# EAGLE design msx_io_expander_slot (EAGLE 7.6.0)
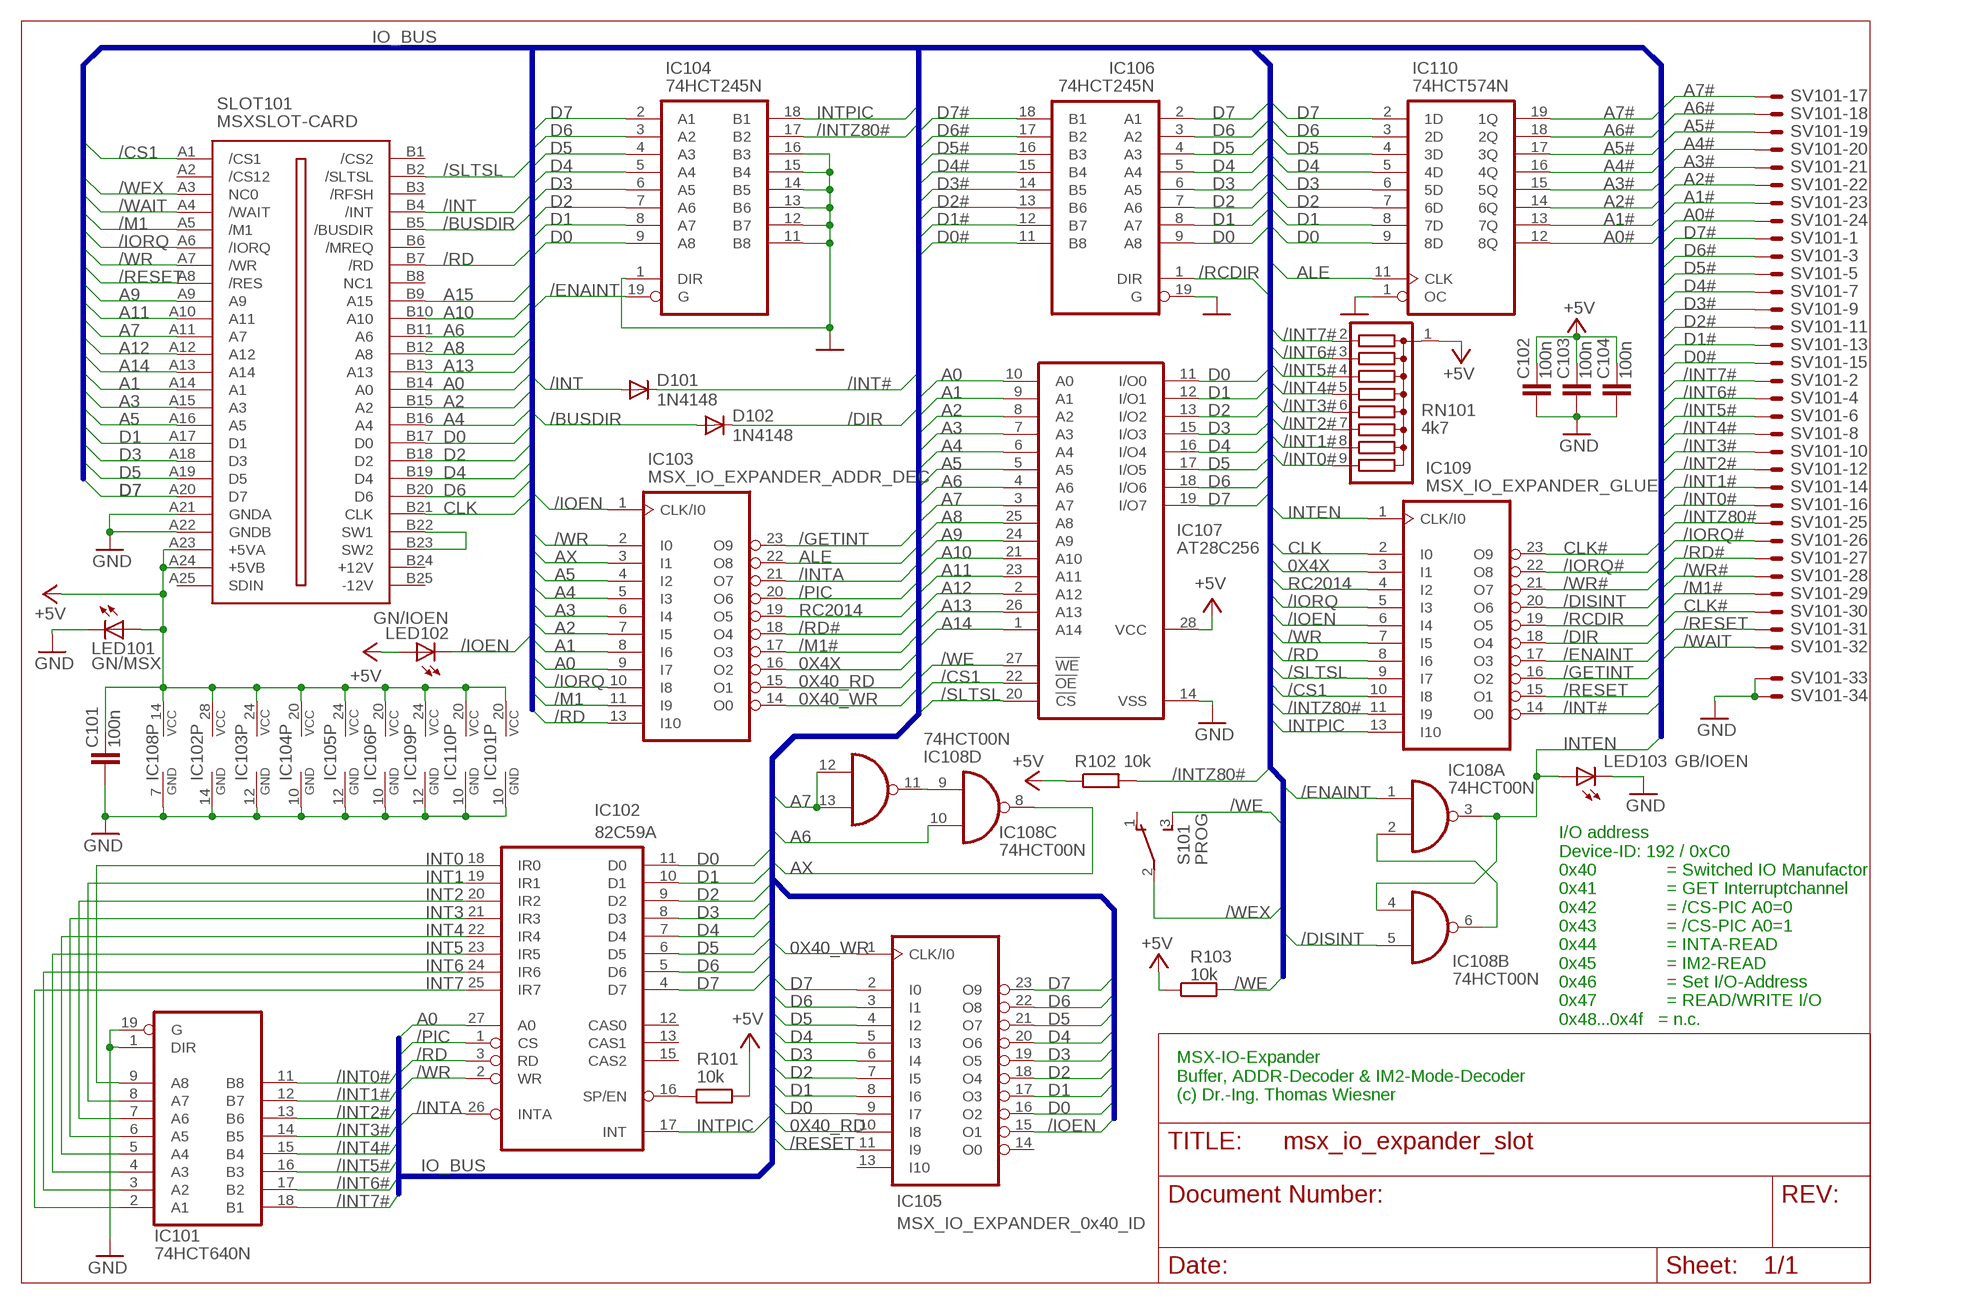
[diagram p0: schematic, sheet 1]

## Parts
C101  100n  C-EU025-025X050  [C025-025X050]
C102  100n  C-EU025-025X050  [C025-025X050]
C103  100n  C-EU025-025X050  [C025-025X050]
C104  100n  C-EU025-025X050  [C025-025X050]
D101  1N4148  1N4148DO35-10  [DO35-10]
D102  1N4148  1N4148DO35-10  [DO35-10]
IC101  74HCT640N  74HCT245N  [DIL20]
IC102  82C59A  8259A  [DIL28-6]
IC103  MSX_IO_EXPANDER_ADDR_DEC  22V10  [DIL24-3]
IC104  74HCT245N  [DIL20]
IC105  MSX_IO_EXPANDER_0x40_ID  22V10  [DIL24-3]
IC106  74HCT245N  [DIL20]
IC107  AT28C256  62256P  [DIL28-6]
IC108  74HCT00N  [DIL14]
IC109  MSX_IO_EXPANDER_GLUE  22V10  [DIL24-3]
IC110  74HCT574N  [DIL20]
LED101  GN/MSX  LED3MM  [LED3MM]
LED102  GN/IOEN  LED3MM  [LED3MM]
LED103  GB/IOEN  LED3MM  [LED3MM]
R101  10k  R-EU_0207/10  [0207/10]
R102  10k  R-EU_0207/10  [0207/10]
R103  10k  R-EU_0207/10  [0207/10]
RN101  4k7  G08R  [SIL9]
S101  PROG  TL36PO  [TL3XPO]
SLOT101  MSXSLOT-CARD  [MSXCARD]
SV101  ML343MLE  [3M_34L]

## Nets
0X4X: IC103.16(O2) IC109.3(I1)
0X40_RD: IC103.15(O1) IC105.10(I8)
0X40_WR: IC103.14(O0) IC105.1(CLK/I0)
+5V: C101.2 C102.2 C103.2 C104.2 IC101.20(VCC) IC102.28(VCC) IC103.24(VCC) IC104.20(VCC) IC105.24(VCC) IC106.20(VCC) IC107.28(VCC) IC108.14(P:VCC) IC109.24(VCC) IC110.20(VCC) LED101.A LED102.A R101.2 R102.1 R103.1 RN101.1 SLOT101.A23(+5VA) SLOT101.A24(+5VB)
/BUSDIR: D102.A SLOT101.B5(/BUSDIR)
/CS1: IC107.22(!OE) IC109.10(I8) SLOT101.A1(/CS1)
/DIR: D102.C IC109.18(O4)
/DISINT: IC108.5(B:I1) IC109.20(O6)
/ENAINT: IC104.19(G) IC108.1(A:I0) IC109.17(O3)
/GETINT: IC103.23(O9) IC109.16(O2)
/INT: D101.A SLOT101.B4(/INT)
/INT0#: IC101.11(B8) RN101.9 SV101.16
/INT1#: IC101.12(B7) RN101.8 SV101.14
/INT2#: IC101.13(B6) RN101.7 SV101.12
/INT3#: IC101.14(B5) RN101.6 SV101.10
/INT4#: IC101.15(B4) RN101.5 SV101.8
/INT5#: IC101.16(B3) RN101.4 SV101.6
/INT6#: IC101.17(B2) RN101.3 SV101.4
/INT7#: IC101.18(B1) RN101.2 SV101.2
/INT#: D101.C IC109.14(O0)
/INTA: IC102.26(INTA) IC103.21(O7)
/INTZ80#: IC104.17(B2) IC109.11(I9) R102.2 SV101.25
/IOEN: IC103.1(CLK/I0) IC105.15(O1) IC109.6(I4) LED102.K(C)
/IORQ: IC103.10(I8) IC109.5(I3) SLOT101.A6(/IORQ)
/IORQ#: IC109.22(O8) SV101.26
/M1: IC103.11(I9) SLOT101.A5(/M1)
/M1#: IC103.17(O3) SV101.29
/PIC: IC102.1(CS) IC103.20(O6)
/RCDIR: IC106.1(DIR) IC109.19(O5)
/RD: IC102.3(RD) IC103.13(I10) IC109.8(I6) SLOT101.B7(/RD)
/RD#: IC103.18(O4) SV101.27
/RESET: IC105.11(I9) IC109.15(O1) SLOT101.A8(/RES) SV101.31
/SLTSL: IC107.20(!CS) IC109.9(I7) SLOT101.B2(/SLTSL)
/WAIT: SLOT101.A4(/WAIT) SV101.32
/WE: IC107.27(!WE) R103.2 S101.3(S)
/WEX: S101.2(P) SLOT101.A3(NC0)
/WR: IC102.2(WR) IC103.2(I0) IC109.7(I5) SLOT101.A7(/WR)
/WR#: IC109.21(O7) SV101.28
A0: IC102.27(A0) IC103.9(I7) IC107.10(A0) SLOT101.B14(A0)
A0#: IC110.12(8Q) SV101.24
A1: IC103.8(I6) IC107.9(A1) SLOT101.A14(A1)
A1#: IC110.13(7Q) SV101.23
A2: IC103.7(I5) IC107.8(A2) SLOT101.B15(A2)
A2#: IC110.14(6Q) SV101.22
A3: IC103.6(I4) IC107.7(A3) SLOT101.A15(A3)
A3#: IC110.15(5Q) SV101.21
A4: IC103.5(I3) IC107.6(A4) SLOT101.B16(A4)
A4#: IC110.16(4Q) SV101.20
A5: IC103.4(I2) IC107.5(A5) SLOT101.A16(A5)
A5#: IC110.17(3Q) SV101.19
A6: IC107.4(A6) IC108.10(C:I1) SLOT101.B11(A6)
A6#: IC110.18(2Q) SV101.18
A7: IC107.3(A7) IC108.12(D:I0) IC108.13(D:I1) SLOT101.A11(A7)
A7#: IC110.19(1Q) SV101.17
A8: IC107.25(A8) SLOT101.B12(A8)
A9: IC107.24(A9) SLOT101.A9
A10: IC107.21(A10) SLOT101.B10(A10)
A11: IC107.23(A11) SLOT101.A10(A11)
A12: IC107.2(A12) SLOT101.A12
A13: IC107.26(A13) SLOT101.B13(A13)
A14: IC107.1(A14) SLOT101.A13(A14)
A15: SLOT101.B9(A15)
ALE: IC103.22(O8) IC110.11(CLK)
AX: IC103.3(I1) IC108.8(C:O)
CLK: IC109.2(I0) SLOT101.B21(CLK)
CLK#: IC109.23(O9) SV101.30
D0: IC102.11(D0) IC104.9(A8) IC105.9(I7) IC105.16(O2) IC106.9(A8) IC107.11(I/O0) IC110.9(8D) SLOT101.B17(D0)
D0#: IC106.11(B8) SV101.15
D1: IC102.10(D1) IC104.8(A7) IC105.8(I6) IC105.17(O3) IC106.8(A7) IC107.12(I/O1) IC110.8(7D) SLOT101.A17(D1)
D1#: IC106.12(B7) SV101.13
D2: IC102.9(D2) IC104.7(A6) IC105.7(I5) IC105.18(O4) IC106.7(A6) IC107.13(I/O2) IC110.7(6D) SLOT101.B18(D2)
D2#: IC106.13(B6) SV101.11
D3: IC102.8(D3) IC104.6(A5) IC105.6(I4) IC105.19(O5) IC106.6(A5) IC107.15(I/O3) IC110.6(5D) SLOT101.A18(D3)
D3#: IC106.14(B5) SV101.9
D4: IC102.7(D4) IC104.5(A4) IC105.5(I3) IC105.20(O6) IC106.5(A4) IC107.16(I/O4) IC110.5(4D) SLOT101.B19(D4)
D4#: IC106.15(B4) SV101.7
D5: IC102.6(D5) IC104.4(A3) IC105.4(I2) IC105.21(O7) IC106.4(A3) IC107.17(I/O5) IC110.4(3D) SLOT101.A19(D5)
D5#: IC106.16(B3) SV101.5
D6: IC102.5(D6) IC104.3(A2) IC105.3(I1) IC105.22(O8) IC106.3(A2) IC107.18(I/O6) IC110.3(2D) SLOT101.B20(D6)
D6#: IC106.17(B2) SV101.3
D7: IC102.4(D7) IC104.2(A1) IC105.2(I0) IC105.23(O9) IC106.2(A1) IC107.19(I/O7) IC110.2(1D) SLOT101.A20(D7)
D7#: IC106.18(B1) SV101.1
GND: C101.1 C102.1 C103.1 C104.1 IC101.1(DIR) IC101.10(GND) IC101.19(G) IC102.14(GND) IC103.12(GND) IC104.1(DIR) IC104.10(GND) IC104.11(B8) IC104.12(B7) IC104.13(B6) IC104.14(B5) IC104.15(B4) IC104.16(B3) IC105.12(GND) IC106.10(GND) IC106.19(G) IC107.14(VSS) IC108.7(P:GND) IC109.12(GND) IC110.1(OC) IC110.10(GND) LED101.K(C) LED103.K(C) SLOT101.A21(GNDA) SLOT101.A22(GNDB) SV101.33 SV101.34
INT0: IC101.9(A8) IC102.18(IR0)
INT1: IC101.8(A7) IC102.19(IR1)
INT2: IC101.7(A6) IC102.20(IR2)
INT3: IC101.6(A5) IC102.21(IR3)
INT4: IC101.5(A4) IC102.22(IR4)
INT5: IC101.4(A3) IC102.23(IR5)
INT6: IC101.3(A2) IC102.24(IR6)
INT7: IC101.2(A1) IC102.25(IR7)
INTEN: IC108.3(A:O) IC108.4(B:I0) IC109.1(CLK/I0) LED103.A
INTPIC: IC102.17(INT) IC104.18(B1) IC109.13(I10)
N$1: IC102.16(SP/EN) R101.1
N$2: IC108.2(A:I1) IC108.6(B:O)
N$3: SLOT101.B22(SW1) SLOT101.B23(SW2)
N$4: IC108.9(C:I0) IC108.11(D:O)
RC2014: IC103.19(O5) IC109.4(I2)
Unconnected: IC102.12(CAS0) IC102.13(CAS1) IC102.15(CAS2) IC105.13(I10) IC105.14(O0) S101.1(O) SLOT101.A2(/CS12) SLOT101.A25(SDIN) SLOT101.B1(/CS2) SLOT101.B3(/RFSH) SLOT101.B6(/MREQ) SLOT101.B8(NC1) SLOT101.B24(+12V) SLOT101.B25(-12V)

## Buses
IO_BUS

## Notes on the sheet
- I/O address
  Device-ID: 192 / 0xC0
  0x40              = Switched IO Manufactor
  0x41              = GET Interruptchannel
  0x42              = /CS-PIC A0=0
  0x43              = /CS-PIC A0=1
  0x44              = INTA-READ
  0x45              = IM2-READ
  0x46              = Set I/O-Address
  0x47              = READ/WRITE I/O
  0x48...0x4f   = n.c.
- MSX-IO-Expander
  Buffer, ADDR-Decoder & IM2-Mode-Decoder
  (c) Dr.-Ing. Thomas Wiesner

## Library data of the parts
C101-C104 = rcl:C-EU: CAPACITOR, European symbol
D101 D102 = diode:1N4148: DIODE high speed (Philips)
IC101 IC104 IC106 = 74xx-eu:74*245: Octal BUS TRANSCEIVER, 3-state
IC102 = micro-intel:8259A: MICROCOMPUTER/PERIPHERAL DEVICE; OC_FARNELL: unknown; OC_NEWARK: unknown
IC103 IC105 IC109 = pal:22V10: PAL; MPN: GAL22V10D-7LPN; OC_FARNELL: 1571925; OC_NEWARK: 97M0480
IC107 = memory-hitachi:62256P: MEMORY; OC_FARNELL: unknown; OC_NEWARK: unknown
IC108 = 74xx-eu:74*00: Quad 2-input NAND gate
IC110 = 74xx-eu:74*574: 8-bit D type FLIP FLOP bus driver
LED101-LED103 = led:LED: LED OSRAM: - CHIPLED LG R971, LG N971, LY N971, LG Q971, LY Q971, LO R971, LY R971 LH N974, LH R974 LS Q976, LO Q976, LY Q976 LO Q996 - Hyper CHIPLED LW Q18S LB Q993, LB Q99A, LB R99A - SideLED LS A670, LO A670, LY A670, LG A670, LP A670 LB A673, LV A673, LT A673, LW A673 LH A674 LY A675 LS A676, LA A676, LO A676, LY A676, LW A676 LS A679, LY A679, LG A679 - Hyper Micro SIDELED® LS Y876, LA Y876, LO Y876, LY Y876 LT Y87S - SmartLED LW L88C, LW L88S LB L89C, LB L89S, LG L890 LS L89K, LO L89K, LY L89K LS L896, LA L896, LO L896, LY L896 - TOPLED LS T670, LO T670, LY T670, LG T670, LP T670 LSG T670, LSP T670, LSY T670, LOP T670, LYG T670 LG T671, LOG T671, LSG T671 LB T673, LV T673, LT T673, LW T673 LH T674 LS T676, LA T676, LO T676, LY T676, LB T676, LH T676, LSB T676, LW T676 LB T67C, LV T67C, LT T67C, LS T67K, LO T67K, LY T67K, LW E67C LS E67B, LA E67B, LO E67B, LY E67B, LB E67C, LV E67C, LT E67C LW T67C LS T679, LY T679, LG T679 LS T770, LO T770, LY T770, LG T770, LP T770 LB T773, LV T773, LT T773, LW T773 LH T774 LS E675, LA E675, LY E675, LS T675 LS T776, LA T776, LO T776, LY T776, LB T776 LHGB T686 LT T68C, LB T68C - Hyper Mini TOPLED® LB M676 - Mini TOPLED Santana® LG M470 LS M47K, LO M47K, LY M47K Source: http://www.osram.convergy.de LUXEON: - LUMILED® LXK2-PW12-R00, LXK2-PW12-S00, LXK2-PW14-U00, LXK2-PW14-V00 LXK2-PM12-R00, LXK2-PM12-S00, LXK2-PM14-U00 LXK2-PE12-Q00, LXK2-PE12-R00, LXK2-PE12-S00, LXK2-PE14-T00, LXK2-PE14-U00 LXK2-PB12-K00, LXK2-PB12-L00, LXK2-PB12-M00, LXK2-PB14-N00, LXK2-PB14-P00, LXK2-PB14-Q00 LXK2-PR12-L00, LXK2-PR12-M00, LXK2-PR14-Q00, LXK2-PR14-R00 LXK2-PD12-Q00, LXK2-PD12-R00, LXK2-PD12-S00 LXK2-PH12-R00, LXK2-PH12-S00 LXK2-PL12-P00, LXK2-PL12-Q00, LXK2-PL12-R00 Source: www.luxeon.com KINGBRIGHT: KA-3528ASYC Source: www.kingbright.com
R101-R103 = resistor:R-EU_: RESISTOR, European symbol
RN101 = resistor-sil:G08R: SIL RESISTOR; OC_FARNELL: unknown; OC_NEWARK: unknown
S101 = switch:TL36PO: TINY SWITCH ON - ON Source: http://www2.produktinfo.conrad.com/datenblaetter/700000-724999/705152-da-01-de-Subminiaturschalter_TL_36YO.pdf
SLOT101 = mbc:MSXSLOT: MSX-Slot-Verbinder
SV101 = con-harting-ml:ML34?E: HARTING; OC_FARNELL: unknown; OC_NEWARK: unknown

## Board
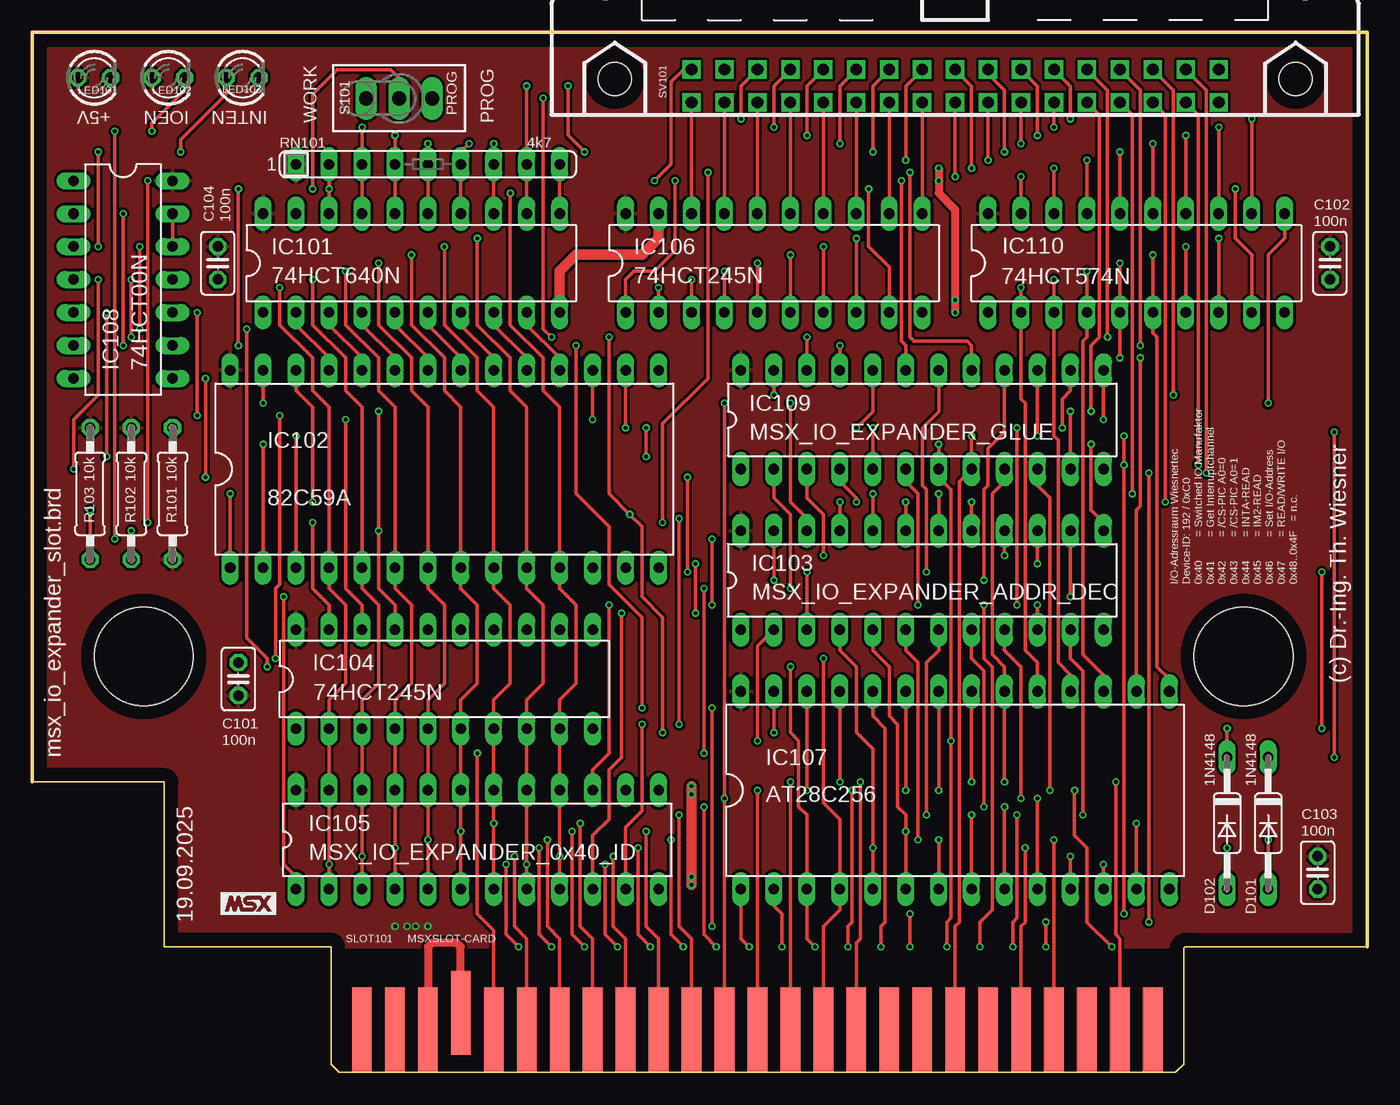
[diagram p1: board, top side]
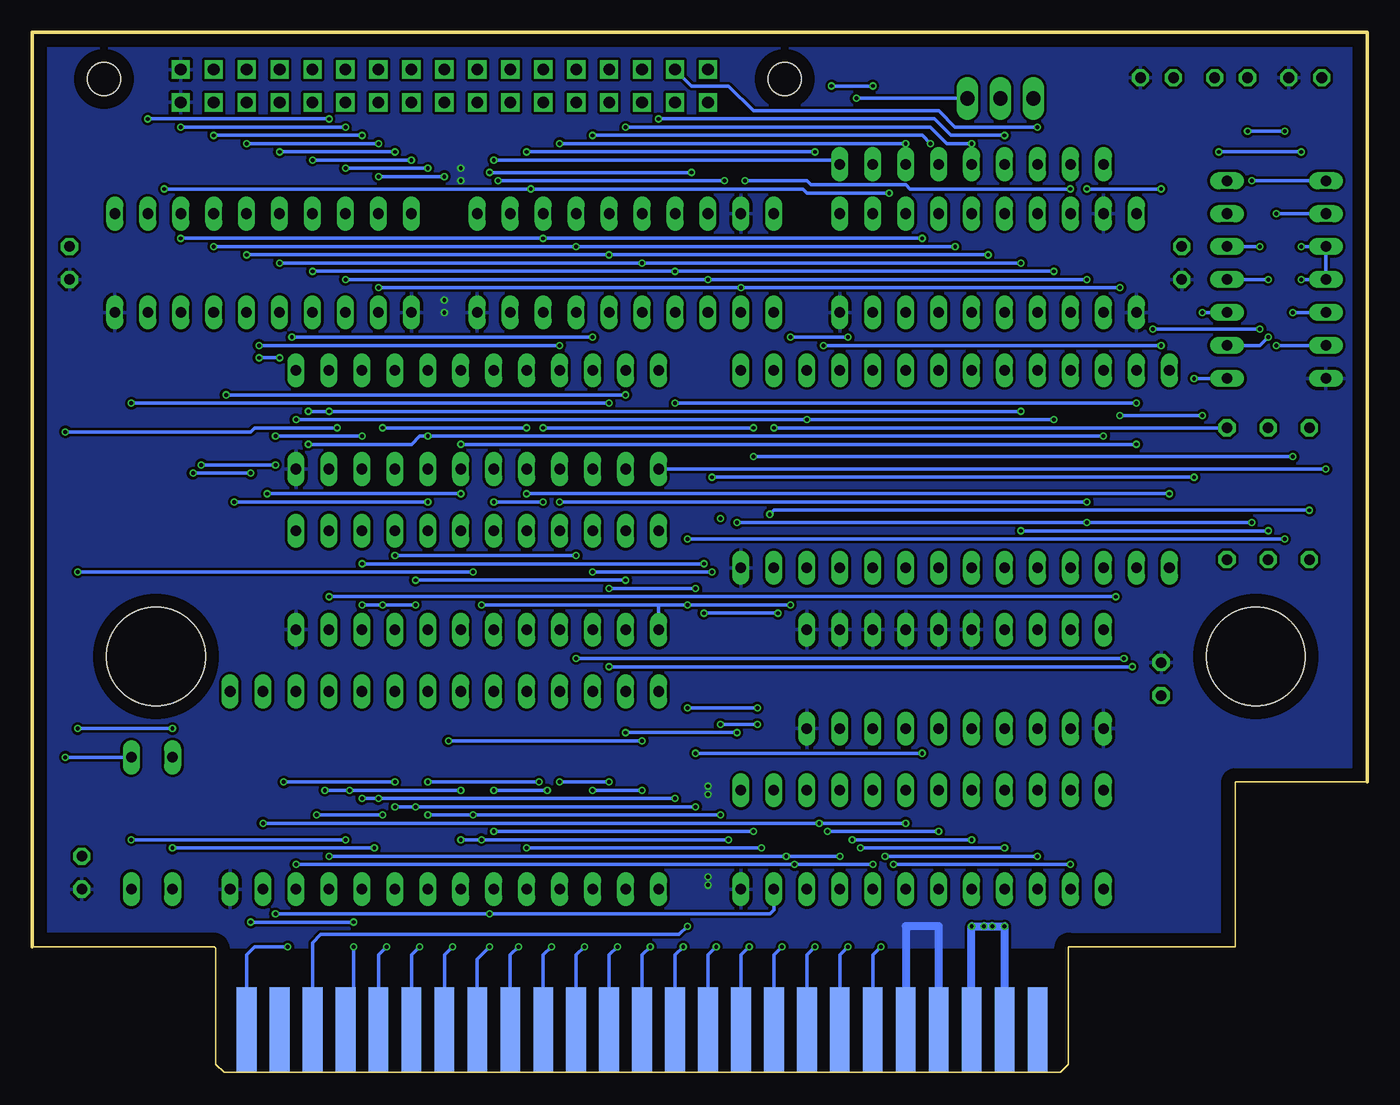
[diagram p2: board, bottom side, seen from below]

Size 102.87 x 80.17 mm. Coordinates in mm from the lower left corner, seen from the top.
Outline: 0,22.38 0,80.17 102.87,80.17 102.87,9.68
Copper layers (1*16): Top 0.035mm / dielectric 1.5mm / Bottom 0.035mm
Design rules "default *": minimum track width 10mil, minimum drill 0.3mm, track to track 8mil, track to pad 4mil, pad to pad 8mil, via to via 8mil, smd to smd 8mil, copper to edge 40mil, drill to drill 8mil, minimum pad ring 10mil, minimum via ring 0.125mm, stop-mask expansion 4mil, vias tented up to drill 0mil, thermal gap 10mil

### Footprints (pad centres in the part's own frame; a part is rotated, then mirrored left to right if it is on the bottom)
C025-025X050 = drill 0.813 octagon: 1 -1.27,0; 2 1.27,0
DO35-10 = drill 0.813 long: A 5.08,0; C -5.08,0
DIL20 = drill 0.813 long: 1 -11.43,-3.81; 2 -8.89,-3.81; 3 -6.35,-3.81; 4 -3.81,-3.81; 5 -1.27,-3.81; 6 1.27,-3.81; 7 3.81,-3.81; 8 6.35,-3.81; 9 8.89,-3.81; 10 11.43,-3.81; 11 11.43,3.81; 12 8.89,3.81; 13 6.35,3.81; 14 3.81,3.81; 15 1.27,3.81; 16 -1.27,3.81; 17 -3.81,3.81; 18 -6.35,3.81; 19 -8.89,3.81; 20 -11.43,3.81
DIL28-6 = drill 0.813 long: 1 -16.51,-7.62; 2 -13.97,-7.62; 3 -11.43,-7.62; 4 -8.89,-7.62; 5 -6.35,-7.62; 6 -3.81,-7.62; 7 -1.27,-7.62; 8 1.27,-7.62; 9 3.81,-7.62; 10 6.35,-7.62; 11 8.89,-7.62; 12 11.43,-7.62; 13 13.97,-7.62; 14 16.51,-7.62; 15 16.51,7.62; 16 13.97,7.62; 17 11.43,7.62; 18 8.89,7.62; 19 6.35,7.62; 20 3.81,7.62; 21 1.27,7.62; 22 -1.27,7.62; 23 -3.81,7.62; 24 -6.35,7.62; 25 -8.89,7.62; 26 -11.43,7.62; 27 -13.97,7.62; 28 -16.51,7.62
DIL24-3 = drill 0.813 long: 1 -13.97,-3.81; 2 -11.43,-3.81; 3 -8.89,-3.81; 4 -6.35,-3.81; 5 -3.81,-3.81; 6 -1.27,-3.81; 7 1.27,-3.81; 8 3.81,-3.81; 9 6.35,-3.81; 10 8.89,-3.81; 11 11.43,-3.81; 12 13.97,-3.81; 13 13.97,3.81; 14 11.43,3.81; 15 8.89,3.81; 16 6.35,3.81; 17 3.81,3.81; 18 1.27,3.81; 19 -1.27,3.81; 20 -3.81,3.81; 21 -6.35,3.81; 22 -8.89,3.81; 23 -11.43,3.81; 24 -13.97,3.81
DIL14 = drill 0.813 long: 1 -7.62,-3.81; 2 -5.08,-3.81; 3 -2.54,-3.81; 4 0,-3.81; 5 2.54,-3.81; 6 5.08,-3.81; 7 7.62,-3.81; 8 7.62,3.81; 9 5.08,3.81; 10 2.54,3.81; 11 0,3.81; 12 -2.54,3.81; 13 -5.08,3.81; 14 -7.62,3.81
LED3MM = drill 0.813 octagon: A -1.27,0; K 1.27,0
0207/10 = drill 0.813 octagon: 1 -5.08,0; 2 5.08,0
SIL9 = drill 0.813 long: 1 -10.16,0; 2 -7.62,0; 3 -5.08,0; 4 -2.54,0; 5 0,0; 6 2.54,0; 7 5.08,0; 8 7.62,0; 9 10.16,0
TL3XPO = drill 1.1 pad 1.422 long: 1 -2.54,0; 2 0,0; 3 2.54,0
MSXCARD = smd 1.524 x 6.477 bottom: A1 -25.4,2.54; A2 -27.94,2.54; A3 -30.48,2.54; A4 -33.02,2.54; A5 -35.56,2.54; A6 -38.1,2.54; A7 -40.64,2.54; A8 -43.18,2.54; A9 -45.72,2.54; A10 -48.26,2.54; A11 -50.8,2.54; A12 -53.34,2.54; A13 -55.88,2.54; A14 -58.42,2.54; A15 -60.96,2.54; A16 -63.5,2.54; A17 -66.04,2.54; A18 -68.58,2.54; A19 -71.12,2.54; A20 -73.66,2.54; A21 -76.2,2.54; A22 -78.74,2.54; A23 -81.28,2.54; A24 -83.82,2.54; A25 -86.36,2.54 | smd 1.524 x 6.477: B1 -25.4,2.54; B2 -27.94,2.54; B3 -30.48,2.54; B4 -33.02,2.54; B5 -35.56,2.54; B6 -38.1,2.54; B7 -40.64,2.54; B8 -43.18,2.54; B9 -45.72,2.54; B10 -48.26,2.54; B11 -50.8,2.54; B12 -53.34,2.54; B13 -55.88,2.54; B14 -58.42,2.54; B15 -60.96,2.54; B16 -63.5,2.54; B17 -66.04,2.54; B18 -68.58,2.54; B19 -71.12,2.54; B20 -73.66,2.54; B21 -76.2,2.54; B22 -78.74,3.81; B23 -81.28,2.54; B24 -83.82,2.54; B25 -86.36,2.54 | hole 7.62: -103.188,31.274; -18.415,31.274
3M_34L = drill 0.9 square: 1 -20.32,-5.08; 2 -20.32,-2.54; 3 -17.78,-5.08; 4 -17.78,-2.54; 5 -15.24,-5.08; 6 -15.24,-2.54; 7 -12.7,-5.08; 8 -12.7,-2.54; 9 -10.16,-5.08; 10 -10.16,-2.54; 11 -7.62,-5.08; 12 -7.62,-2.54; 13 -5.08,-5.08; 14 -5.08,-2.54; 15 -2.54,-5.08; 16 -2.54,-2.54; 17 0,-5.08; 18 0,-2.54; 19 2.54,-5.08; 20 2.54,-2.54; 21 5.08,-5.08; 22 5.08,-2.54; 23 7.62,-5.08; 24 7.62,-2.54; 25 10.16,-5.08; 26 10.16,-2.54; 27 12.7,-5.08; 28 12.7,-2.54; 29 15.24,-5.08; 30 15.24,-2.54; 31 17.78,-5.08; 32 17.78,-2.54; 33 20.32,-5.08; 34 20.32,-2.54 | hole 2.54: -26.238,-3.277; 26.238,-3.277

### Placement (x,y rotation side)
C101  15.88,30.32 270 top
C102  100.01,62.39 90 top
C103  99.06,15.4 90 top
C104  14.29,62.39 90 top
D101  95.25,19.21 270 top
D102  92.08,19.21 270 top
IC101  29.21,62.39 0 top
IC102  31.75,46.51 0 top
IC103  68.58,37.94 0 top
IC104  31.75,30.32 0 top
IC105  34.29,17.94 0 top
IC106  57.15,62.39 0 top
IC107  71.12,21.75 0 top
IC108  6.99,61.12 270 top
IC109  68.58,50.32 0 top
IC110  85.09,62.39 0 top
LED101  4.76,76.68 0 top
LED102  10.48,76.68 0 top
LED103  16.19,76.68 0 top
R101  10.79,44.61 270 top
R102  7.62,44.61 270 top
R103  4.45,44.61 270 top
RN101  30.48,70.01 0 top
S101  28.26,75.09 0 top
SLOT101  111.76,0.79 0 top
SV101  71.12,79.85 0 top

### Tracks (layer width: path | path; a pad name or v marks a point on that pad's centre or on a via)
0X4X  (via drill 0.3)
  Top 0.254: IC109.3 59.69,44.29 60.96,43.02 v60.96,39.85 | v74.93,39.85 IC103.16
  Bottom 0.254: v60.96,39.85 v74.93,39.85
0X40_RD  (via drill 0.3)
  Top 0.254: IC105.10 43.18,18.26 44.45,19.53 44.45,23.34 45.4,24.29 v45.4,35.4 | v51.12,35.4 v51.12,39.21 | v77.47,39.21 IC103.15
  Bottom 0.254: v45.4,35.4 v51.12,35.4 | v51.12,39.21 v77.47,39.21
0X40_WR  (via drill 0.3)
  Top 0.254: IC105.1 20.32,15.08 19.37,16.03 v19.37,36.67 | v80.01,36.67 IC103.14
  Bottom 0.254: v19.37,36.67 v80.01,36.67
+5V  (via drill 0.3)
  Bottom 0.61: SLOT101.A23 v30.48,11.27 v29.53,11.27 v28.89,11.27 v27.94,11.27 SLOT101.A24
  pour Top: 0,80.17 102.87,80.17 102.87,9.68 10.16,9.68 10.16,22.38 0,22.38
/BUSDIR  (via drill 0.3)
  Top 0.254: SLOT101.B5 76.2,11.27 76.52,11.59 v76.52,17.3 | v92.08,17.3 D102.A
  Bottom 0.254: v76.52,17.3 v92.08,17.3
/CS1  (via drill 0.3)
  Top 0.254: v83.19,9.68 81.28,11.59 81.28,17.3 80.33,18.26 v80.33,21.75 | v69.85,21.75 IC107.22 | IC109.10 77.47,45.24 78.42,44.29 v78.42,21.75
  Bottom 0.254: v83.19,9.68 85.72,9.68 86.36,9.05 SLOT101.A1 | v80.33,21.75 v78.42,21.75 v69.85,21.75
/DIR  (via drill 0.3)
  Top 0.254: IC109.18 69.85,50.96 68.58,49.69 68.58,45.24 68.9,44.93 v68.9,38.58 | v99.38,38.58 v99.38,26.51 | v92.08,26.51 D102.C
  Bottom 0.254: v68.9,38.58 v99.38,38.58 | v99.38,26.51 v92.08,26.51
/DISINT  (via drill 0.3)
  Top 0.254: v5.71,58.58 v5.71,47.47 | IC109.20 64.77,50.96 v63.5,49.69 | v47.31,49.69 v47.31,47.47
  Bottom 0.254: IC108.5 v5.71,58.58 | v5.71,47.47 v47.31,47.47 | v63.5,49.69 v47.31,49.69
/ENAINT  (via drill 0.3)
  Top 0.254: IC104.19 22.86,36.04 21.59,37.31 v21.59,42.39 | v8.89,42.39 v8.89,68.74 | IC109.17 72.39,56.04 72.07,56.36 67.94,56.36 67.63,56.67 v67.63,69.37 | v48.58,42.39 48.58,50.01 52.07,53.5 v52.07,69.37
  Bottom 0.254: v8.89,42.39 v21.59,42.39 v48.58,42.39 | v8.89,68.74 IC108.1 | v67.63,69.37 v52.07,69.37
/GETINT  (via drill 0.3)
  Top 0.254: IC109.16 74.93,49.37 73.66,48.1 73.66,45.24 73.34,44.93 v73.34,37.94 | v57.15,37.94 IC103.23
  Bottom 0.254: v73.34,37.94 v57.15,37.94
/INT  (via drill 0.3)
  Top 0.254: SLOT101.B4 v78.74,17.94 | v95.25,17.94 D101.A
  Bottom 0.254: v78.74,17.94 v95.25,17.94
/INT0#  (via drill 0.3)
  Top 0.254: SV101.16 67.31,76.04 v67.31,70.33 | IC101.11 RN101.9
  Bottom 0.254: v67.31,70.33 40.96,70.33 RN101.9
/INT1#  (via drill 0.3)
  Top 0.254: SV101.14 64.77,76.04 v64.77,70.96 | v42.55,70.96 41.27,72.23 v41.27,76.04 | v38.1,76.04 RN101.8 IC101.12
  Bottom 0.254: v64.77,70.96 v42.55,70.96 | v41.27,76.04 v38.1,76.04
/INT2#  (via drill 0.3)
  Top 0.254: SV101.12 62.23,76.04 v62.23,71.6 | IC101.13 RN101.7 v35.56,71.6
  Bottom 0.254: v62.23,71.6 v35.56,71.6
/INT3#  (via drill 0.3)
  Top 0.254: SV101.10 59.69,76.04 v59.69,72.23 | IC101.14 RN101.6 33.02,70.64 33.02,70.96 v33.66,71.6
  Bottom 0.254: v59.69,72.23 34.29,72.23 v33.66,71.6
/INT4#  (via drill 0.3)
  Top 0.254: SV101.8 57.15,76.04 v57.15,72.87 | IC101.15 RN101.5 v30.48,71.6
  Bottom 0.254: v57.15,72.87 33.66,72.87 32.38,71.6 v30.48,71.6
/INT5#  (via drill 0.3)
  Top 0.254: SV101.6 54.61,76.04 v54.61,73.5 | IC101.16 RN101.4 v27.94,72.23
  Bottom 0.254: v54.61,73.5 33.34,73.5 32.07,72.23 v27.94,72.23
/INT6#  (via drill 0.3)
  Top 0.254: IC101.17 RN101.3 v25.4,72.87
  Bottom 0.254: SV101.4 52.07,76.04 49.21,76.04 47.31,74.14 33.02,74.14 31.75,72.87 v25.4,72.87
/INT7#  (via drill 0.3)
  Top 0.254: IC101.18 v22.86,68.1 RN101.2 | SV101.2 50.16,77.31 49.21,76.36 49.21,70.01 v47.94,68.74
  Bottom 0.254: v47.94,68.74 43.18,68.74 42.86,68.42 35.56,68.42 35.24,68.1 v22.86,68.1
/INT#  (via drill 0.3)
  Top 0.254: IC109.14 80.01,52.55 79.38,51.91 v79.38,49.69 | v100.33,49.37 v100.33,24.29
  Bottom 0.254: v79.38,49.69 85.72,49.69 86.04,49.37 v100.33,49.37 | v100.33,24.29 D101.C
/INTA  (via drill 0.3)
  Top 0.254: IC102.26 20.32,52.55 21.59,51.28 v21.59,43.97 | v62.23,43.97 IC103.21
  Bottom 0.254: v21.59,43.97 v62.23,43.97
/INTZ80#  (via drill 0.3)
  Top 0.254: SV101.25 82.23,73.82 82.23,56.67 81.6,56.04 v81.6,50.96 | v26.67,50.96 v26.67,41.75 26.67,37.31 27.94,36.04 IC104.17 | R102.2 v7.62,41.75 | IC109.11 v80.01,50.96
  Bottom 0.254: v81.6,50.96 v80.01,50.96 v26.67,50.96 | v7.62,41.75 v26.67,41.75
/IOEN  (via drill 0.3)
  Top 0.254: LED102.K 11.75,75.72 9.21,73.18 v9.21,72.55 | v6.35,72.55 v6.35,41.12 | v52.39,41.12 v52.39,36.04 | IC109.6 67.31,45.56 68.26,44.61 v68.26,36.04 | IC105.15 43.18,23.34 44.45,24.61 v44.45,36.04
  Bottom 0.254: v9.21,72.55 v6.35,72.55 | v6.35,41.12 v52.39,41.12 | 54.61,36.04 v52.39,36.04 v44.45,36.04 | 54.61,36.04 IC103.1 | v68.26,36.04 54.61,36.04
/IORQ  (via drill 0.3)
  Top 0.254: v73.03,9.68 73.03,11.59 73.98,12.54 73.98,31.27 73.34,31.91 v73.34,36.04 | v77.47,36.04 IC103.10 | IC109.5 v64.77,49.69 | v75.88,49.69 v75.88,36.04
  Bottom 0.254: SLOT101.A6 73.66,9.05 v73.03,9.68 | v73.34,36.04 v75.88,36.04 v77.47,36.04 | v64.77,49.69 v75.88,49.69
/IORQ#  (via drill 0.3)
  Top 0.254: SV101.26 82.87,75.72 v82.87,56.67 | v59.69,56.67 IC109.22
  Bottom 0.254: v82.87,56.67 v59.69,56.67
/M1  (via drill 0.3)
  Top 0.254: v75.56,9.68 75.56,11.59 75.88,11.91 v75.88,19.84 | v80.96,19.84 80.96,30.96 80.01,31.91 IC103.11
  Bottom 0.254: SLOT101.A5 76.2,9.05 v75.56,9.68 | v75.88,19.84 v80.96,19.84
/M1#  (via drill 0.3)
  Top 0.254: SV101.29 87.31,73.82 v87.31,43.97 | v72.39,43.97 IC103.17
  Bottom 0.254: v87.31,43.97 v72.39,43.97
/PIC  (via drill 0.3)
  Top 0.254: IC102.1 v15.24,44.61 | v64.77,44.61 IC103.20
  Bottom 0.254: v15.24,44.61 v64.77,44.61
/RCDIR  (via drill 0.3)
  Top 0.254: IC109.19 67.31,56.04 66.99,56.36 v66.99,68.74 | v49.53,68.74 49.53,63.34 47.94,61.75 46.35,61.75 45.72,61.12 IC106.1 45.72,57.63
  Bottom 0.254: v66.99,68.74 v49.53,68.74
/RD  (via drill 0.3)
  Top 0.254: v72.39,49.05 IC109.8 71.44,45.56 71.44,11.59 71.12,11.27 SLOT101.B7 | v20.32,49.05 IC102.3 | IC103.13 82.55,42.39 81.6,43.34 v81.6,48.42
  Bottom 0.254: v20.32,49.05 v72.39,49.05 73.03,49.05 73.66,48.42 v81.6,48.42
/RD#  (via drill 0.3)
  Top 0.254: SV101.27 84.77,73.82 v84.77,44.61 | v69.85,44.61 IC103.18
  Bottom 0.254: v84.77,44.61 v69.85,44.61
/RESET  (via drill 0.3)
  Top 0.254: SV101.31 89.85,73.82 v89.85,46.83 | v84.14,12.22 v84.14,46.83 v84.14,49.05 | v67.63,9.68 v67.63,12.22 | v49.85,42.7 v49.85,26.83 | v46.99,26.83 46.99,20.16 45.72,18.89 IC105.11 | v77.47,49.05 IC109.15
  Bottom 0.254: v89.85,46.83 v84.14,46.83 | v84.14,12.22 v67.63,12.22 46.04,12.22 45.72,12.54 IC105.11 | SLOT101.A8 68.58,8.73 v67.63,9.68 | v49.85,26.83 v46.99,26.83 | v84.14,49.05 v77.47,49.05
/SLTSL  (via drill 0.3)
  Top 0.254: SLOT101.B2 83.82,10.32 83.5,10.64 v83.5,22.38 | v74.93,22.38 IC107.20 74.93,31.27 73.98,32.23 73.98,44.61 74.93,45.56 IC109.9
  Bottom 0.254: v83.5,22.38 v74.93,22.38
/WAIT  (via drill 0.3)
  Top 0.254: SV101.32 90.49,75.72 v90.49,46.2 | v86.04,46.2 v86.04,11.59 | v78.11,11.59 v78.11,9.68
  Bottom 0.254: v90.49,46.2 v86.04,46.2 | v86.04,11.59 v78.11,11.59 | v78.11,9.68 78.11,6.51 SLOT101.A4
/WE  (via drill 0.3)
  Top 0.254: v39.37,75.09 39.37,57.31 v40.01,56.67 | v44.45,56.67 44.45,44.61 v46.04,43.02 46.99,42.07 46.99,36.67 48.58,35.08 v48.58,26.19 | v57.15,26.19 IC107.27 | R103.2 v4.45,43.34
  Bottom 0.254: S101.3 v39.37,75.09 | v40.01,56.67 v44.45,56.67 | v48.58,26.19 v57.15,26.19 | v4.45,43.34 45.72,43.34 v46.04,43.02
/WEX  (via drill 0.3)
  Top 0.254: v52.39,11.27 v52.39,28.1 | v46.99,28.1 46.99,35.08 44.45,37.62 44.45,42.07 41.91,44.61 v41.91,56.04 | v15.88,56.04 v15.88,68.1 | v21.59,68.1 21.59,75.41 23.5,77.31 27.62,77.31 28.26,76.68 S101.2
  Bottom 0.254: SLOT101.A3 81.28,10 80.64,10.64 53.02,10.64 v52.39,11.27 | v52.39,28.1 v46.99,28.1 | v41.91,56.04 v15.88,56.04 | v15.88,68.1 v21.59,68.1
/WR  (via drill 0.3)
  Top 0.254: v69.85,48.42 IC109.7 69.85,45.88 70.8,44.93 v70.8,25.56 70.8,11.91 70.48,11.59 v70.48,9.68 | v17.78,48.42 IC102.2 | IC103.2 55.88,32.86 v55.88,25.56
  Bottom 0.254: v69.85,48.42 v17.78,48.42 | SLOT101.A7 71.12,9.05 v70.48,9.68 | v55.88,25.56 v70.8,25.56
/WR#  (via drill 0.3)
  Top 0.254: SV101.28 85.41,75.72 v85.41,56.04 | v62.23,56.04 IC109.21
  Bottom 0.254: v85.41,56.04 v62.23,56.04
A0  (via drill 0.3)
  Top 0.254: v53.34,51.59 v53.34,21.11 SLOT101.B14 | v17.78,51.59 IC102.27 | v77.47,21.11 IC107.10 | IC103.9 74.93,32.54 76.2,31.27 v76.2,21.11
  Bottom 0.254: v53.34,51.59 v17.78,51.59 | v53.34,21.11 v76.2,21.11 v77.47,21.11
A0#  (via drill 0.3)
  Top 0.254: SV101.24 80.01,76.04 v80.01,73.5 | v93.98,73.5 IC110.12
  Bottom 0.254: v80.01,73.5 v93.98,73.5
A1  (via drill 0.3)
  Top 0.254: v52.7,9.68 51.75,10.64 v51.75,20.48 | v74.93,20.48 IC107.9 | IC103.8 72.39,31.91 73.34,30.96 v73.34,20.48
  Bottom 0.254: SLOT101.A14 53.34,9.05 v52.7,9.68 | v51.75,20.48 v73.34,20.48 v74.93,20.48
A1#  (via drill 0.3)
  Top 0.254: SV101.23 v78.74,72.87 | v91.44,72.87 IC110.13
  Bottom 0.254: v78.74,72.87 v91.44,72.87
A2  (via drill 0.3)
  Top 0.254: SLOT101.B15 50.8,10.32 49.85,11.27 v49.85,19.84 | v72.39,19.84 IC107.8 | IC103.7 69.85,32.54 68.9,31.59 v68.9,19.84
  Bottom 0.254: v49.85,19.84 v68.9,19.84 v72.39,19.84
A2#  (via drill 0.3)
  Top 0.254: SV101.22 77.47,76.04 v77.47,72.23 | v88.9,72.23 IC110.14
  Bottom 0.254: v77.47,72.23 v88.9,72.23
A3  (via drill 0.3)
  Top 0.254: v50.16,9.68 49.21,10.64 v49.21,17.94 | v69.85,17.94 IC107.7 | IC103.6 67.31,32.54 68.26,31.59 v68.26,17.94
  Bottom 0.254: SLOT101.A15 50.8,9.05 v50.16,9.68 | v49.21,17.94 v68.26,17.94 v69.85,17.94
A3#  (via drill 0.3)
  Top 0.254: SV101.21 v76.2,71.6 | v86.36,71.6 IC110.15
  Bottom 0.254: v76.2,71.6 v86.36,71.6
A4  (via drill 0.3)
  Top 0.254: SLOT101.B16 48.26,10.32 47.31,11.27 v47.31,18.57 | IC107.6 v67.31,18.57 67.31,19.84 66.67,20.48 66.67,26.83 66.04,27.46 66.04,31.27 64.77,32.54 IC103.5
  Bottom 0.254: v47.31,18.57 v67.31,18.57
A4#  (via drill 0.3)
  Top 0.254: SV101.20 73.66,76.99 74.93,75.72 v74.93,70.96 | v83.82,70.96 IC110.16
  Bottom 0.254: v74.93,70.96 v83.82,70.96
A5  (via drill 0.3)
  Top 0.254: v47.62,9.68 46.67,10.64 v46.67,17.3 | IC107.5 v64.77,17.3 64.77,24.92 63.5,26.19 63.5,31.27 62.23,32.54 IC103.4
  Bottom 0.254: SLOT101.A16 48.26,9.05 v47.62,9.68 | v46.67,17.3 v64.77,17.3
A5#  (via drill 0.3)
  Top 0.254: SV101.19 v73.66,70.33 | v81.28,70.33 IC110.17
  Bottom 0.254: v73.66,70.33 v81.28,70.33
A6  (via drill 0.3)
  Top 0.254: SLOT101.B11 60.96,11.27 62.23,12.54 IC107.4 62.23,19.53 60.96,20.8 v60.96,31.91 | v18.73,31.91 18.73,37.31 19.05,37.62 v19.05,50.64 | v12.7,50.64 v12.7,58.58
  Bottom 0.254: v60.96,31.91 v18.73,31.91 | v19.05,50.64 v12.7,50.64 | v12.7,58.58 IC108.10
A6#  (via drill 0.3)
  Top 0.254: SV101.18 72.39,76.04 v72.39,69.69 | v78.74,69.69 IC110.18
  Bottom 0.254: v72.39,69.69 v78.74,69.69
A7  (via drill 0.3)
  Top 0.254: v60.33,9.68 59.69,10.32 IC107.3 59.69,19.84 59.05,20.48 59.05,25.56 58.42,26.19 v58.42,31.27 | v18.1,31.27 18.1,31.91 16.51,33.5 v16.51,57.31 | v8.26,57.31 v8.26,63.66 | IC108.13 IC108.12
  Bottom 0.254: SLOT101.A11 60.96,9.05 v60.33,9.68 | v58.42,31.27 v18.1,31.27 | v16.51,57.31 v8.26,57.31 | v8.26,63.66 IC108.12
A7#  (via drill 0.3)
  Top 0.254: SV101.17 v71.12,69.06 | v76.2,69.06 IC110.19
  Bottom 0.254: v71.12,69.06 v76.2,69.06
A8  (via drill 0.3)
  Top 0.254: SLOT101.B12 v58.42,22.38 | v62.23,22.38 IC107.25
  Bottom 0.254: v58.42,22.38 v62.23,22.38
A9  (via drill 0.3)
  Top 0.254: v65.41,9.68 65.41,11.27 65.72,11.59 65.72,26.51 64.77,27.46 IC107.24
  Bottom 0.254: SLOT101.A9 66.04,9.05 v65.41,9.68
A10  (via drill 0.3)
  Top 0.254: SLOT101.B10 63.5,10 63.82,10.32 v63.82,22.38 | v72.39,22.38 IC107.21
  Bottom 0.254: v63.82,22.38 v72.39,22.38
A11  (via drill 0.3)
  Top 0.254: v62.87,9.68 62.87,11.27 63.18,11.59 v63.18,21.75 | v67.31,21.75 IC107.23
  Bottom 0.254: SLOT101.A10 63.5,9.05 v62.87,9.68 | v63.18,21.75 v67.31,21.75
A12  (via drill 0.3)
  Top 0.254: v57.78,9.68 57.78,12.22 57.15,12.86 IC107.2
  Bottom 0.254: SLOT101.A12 58.42,9.05 v57.78,9.68
A13  (via drill 0.3)
  Top 0.254: SLOT101.B13 v55.88,21.75 | v59.69,21.75 IC107.26
  Bottom 0.254: v55.88,21.75 v59.69,21.75
A14  (via drill 0.3)
  Top 0.254: v55.24,9.68 54.61,10.32 IC107.1
  Bottom 0.254: SLOT101.A13 55.88,9.05 v55.24,9.68
ALE  (via drill 0.3)
  Top 0.254: IC110.11 96.52,64.29 95.25,63.02 v95.25,51.59 | v58.42,51.59 58.42,43.97 59.69,42.7 IC103.22
  Bottom 0.254: v95.25,51.59 v58.42,51.59
AX  (via drill 0.3)
  Top 0.254: v13.34,53.5 v13.34,45.88 | v50.48,45.88 v50.48,38.58 | v59.69,38.58 IC103.3
  Bottom 0.254: IC108.8 v13.34,53.5 | v13.34,45.88 v50.48,45.88 | v50.48,38.58 v59.69,38.58
CLK  (via drill 0.3)
  Top 0.254: IC109.2 57.15,44.29 58.42,43.02 v58.42,37.31 | v51.75,37.31 v51.75,24.61 | v34.29,24.61 34.29,12.22 35.56,10.95 SLOT101.B21
  Bottom 0.254: v58.42,37.31 v51.75,37.31 | v51.75,24.61 v34.29,24.61
CLK#  (via drill 0.3)
  Top 0.254: SV101.30 87.95,75.72 v87.95,52.23 | v57.15,52.23 IC109.23
  Bottom 0.254: v87.95,52.23 v57.15,52.23
D0  (via drill 0.3)
  Top 0.254: IC106.9 66.04,62.07 64.45,63.66 v64.45,68.1 | v36.83,67.79 36.83,57.63 39.37,55.09 39.37,52.55 40.64,51.28 IC102.11 40.64,37.31 41.91,36.04 41.91,30 40.64,28.73 IC104.9 IC105.16 v40.64,16.67 IC105.9 | IC110.9 93.98,63.02 92.71,64.29 v92.71,68.1 | SLOT101.B17 45.72,10.32 44.77,11.27 v44.77,16.67 | v80.01,16.67 IC107.11
  Bottom 0.254: v36.83,67.79 43.18,67.79 43.5,68.1 v64.45,68.1 v92.71,68.1 | v40.64,16.67 v44.77,16.67 v80.01,16.67
D0#
  Top 0.254: IC106.11 SV101.15
D1  (via drill 0.3)
  Top 0.254: v34.29,64.29 34.29,57.63 36.83,55.09 36.83,52.55 38.1,51.28 IC102.10 38.1,37.31 39.37,36.04 39.37,30 38.1,28.73 IC104.8 IC105.17 v38.1,16.03 IC105.8 | v63.5,64.29 IC106.8 | IC110.8 v91.44,64.29 | v45.09,9.68 44.13,10.64 v44.13,16.03 | v82.55,16.03 IC107.12
  Bottom 0.254: v34.29,64.29 v63.5,64.29 v91.44,64.29 | SLOT101.A17 45.72,9.05 v45.09,9.68 | v38.1,16.03 v44.13,16.03 v82.55,16.03
D1#
  Top 0.254: IC106.12 SV101.13
D2  (via drill 0.3)
  Top 0.254: v31.75,63.66 31.75,57.63 34.29,55.09 34.29,52.55 35.56,51.28 IC102.9 35.56,37.31 36.83,36.04 36.83,30 35.56,28.73 IC104.7 IC105.18 v35.56,19.21 IC105.7 | v60.96,63.66 IC106.7 | IC110.7 v88.9,63.66 | SLOT101.B18 43.18,10.32 42.23,11.27 v42.23,19.21 | v85.09,19.21 IC107.13
  Bottom 0.254: v31.75,63.66 v60.96,63.66 v88.9,63.66 | v35.56,19.21 v42.23,19.21 v85.09,19.21
D2#
  Top 0.254: IC106.13 SV101.11
D3  (via drill 0.3)
  Top 0.254: v29.21,63.02 29.21,57.63 31.75,55.09 31.75,52.55 33.02,51.28 IC102.8 33.02,37.31 34.29,36.04 34.29,30 33.02,28.73 IC104.6 IC105.19 v33.02,18.57 IC105.6 | v58.42,63.02 IC106.6 | v86.36,63.02 IC110.6 86.36,56.99 86.68,56.67 86.68,31.27 87.63,30.32 IC107.15 | v42.55,9.68 41.59,10.64 v41.59,18.57
  Bottom 0.254: v29.21,63.02 v58.42,63.02 v86.36,63.02 | SLOT101.A18 43.18,9.05 v42.55,9.68 | v41.59,18.57 v33.02,18.57
D3#
  Top 0.254: IC106.14 SV101.9
D4  (via drill 0.3)
  Top 0.254: v26.67,62.39 26.67,57.63 29.21,55.09 29.21,52.55 30.48,51.28 IC102.7 30.48,37.31 31.75,36.04 31.75,30 30.48,28.73 IC104.5 IC105.20 v30.48,17.94 IC105.5 | v55.88,62.39 IC106.5 | v83.82,62.39 IC110.5 v83.82,55.09 | IC107.16 85.09,43.34 85.41,43.66 v85.41,55.09 | SLOT101.B19 40.64,10.32 39.69,11.27 v39.69,17.94
  Bottom 0.254: v26.67,62.39 v55.88,62.39 v83.82,62.39 | v85.41,55.09 v83.82,55.09 | v39.69,17.94 v30.48,17.94
D4#
  Top 0.254: IC106.15 SV101.7
D5  (via drill 0.3)
  Top 0.254: v24.13,61.75 24.13,57.63 26.67,55.09 26.67,52.55 27.94,51.28 IC102.6 27.94,37.31 29.21,36.04 29.21,30 27.94,28.73 IC104.4 IC105.21 v27.94,17.3 IC105.4 | v53.34,61.75 IC106.4 | v81.28,61.75 IC110.4 81.28,56.67 80.96,56.36 80.96,32.23 82.55,30.64 IC107.17 | v40.01,9.68 39.05,10.64 v39.05,17.3
  Bottom 0.254: v24.13,61.75 v53.34,61.75 v81.28,61.75 | SLOT101.A19 40.64,9.05 v40.01,9.68 | v39.05,17.3 v27.94,17.3
D5#
  Top 0.254: IC106.16 SV101.5
D6  (via drill 0.3)
  Top 0.254: v21.59,61.12 21.59,57.63 24.13,55.09 24.13,52.55 25.4,51.28 IC102.5 25.4,37.31 26.67,36.04 26.67,30 25.4,28.73 IC104.3 IC105.22 v25.4,16.67 IC105.3 | v50.8,61.12 IC106.3 | v78.74,61.12 IC110.3 78.74,49.05 79.06,48.74 79.06,31.59 80.01,30.64 IC107.18 | SLOT101.B20 38.1,10.32 37.15,11.27 v37.15,16.67
  Bottom 0.254: v21.59,61.12 v50.8,61.12 v78.74,61.12 | v37.15,16.67 v25.4,16.67
D6#
  Top 0.254: IC106.17 SV101.3
D7  (via drill 0.3)
  Top 0.254: v19.05,60.48 19.05,57.63 21.59,55.09 21.59,52.55 22.86,51.28 IC102.4 22.86,37.31 24.13,36.04 24.13,30 22.86,28.73 IC104.2 IC105.23 v22.86,16.03 IC105.2 | v48.26,60.48 IC106.2 | v76.2,60.48 IC110.2 76.2,51.91 76.52,51.59 76.52,32.54 77.47,31.59 IC107.19 | v37.47,9.68 36.51,10.64 v36.51,16.03
  Bottom 0.254: v19.05,60.48 v48.26,60.48 v76.2,60.48 | SLOT101.A20 38.1,9.05 v37.47,9.68 | v36.51,16.03 v22.86,16.03
D7#
  Top 0.254: IC106.18 SV101.1
GND  (via drill 0.3)
  Top 0.61: v69.85,69.69 v69.85,68.74 69.85,67.79 71.12,66.52 v71.12,59.53 v71.12,58.58
  Top 0.813: IC106.19 48.26,64.29 46.99,63.02 41.91,63.02 40.64,61.75 IC101.10 | v50.8,14.45 v50.8,15.08 v50.8,21.43 v50.8,22.07
  Bottom 0.61: SLOT101.A22 33.02,11.27 35.56,11.27 SLOT101.A21
  pour Bottom: 0,80.17 102.87,80.17 102.87,9.68 10.16,9.68 10.16,22.38 0,22.38
INT0
  Top 0.254: IC101.9 38.1,57.63 40.64,55.09 IC102.18
INT1
  Top 0.254: IC101.8 35.56,57.63 38.1,55.09 IC102.19
INT2
  Top 0.254: IC101.7 33.02,57.63 35.56,55.09 IC102.20
INT3
  Top 0.254: IC101.6 30.48,57.63 33.02,55.09 IC102.21
INT4
  Top 0.254: IC101.5 27.94,57.63 30.48,55.09 IC102.22
INT5
  Top 0.254: IC101.4 25.4,57.63 27.94,55.09 IC102.23
INT6
  Top 0.254: IC101.3 22.86,57.63 25.4,55.09 IC102.24
INT7
  Top 0.254: IC101.2 20.32,57.63 22.86,55.09 IC102.25
INTEN  (via drill 0.3)
  Top 0.254: v3.17,46.51 3.17,50.32 5.08,52.23 v5.08,61.12 | v5.08,63.66 v5.08,70.96 | v11.43,70.96 11.43,71.91 14.92,75.41 LED103.A
  Bottom 0.254: IC109.1 v3.17,46.51 | v5.08,61.12 IC108.4 IC108.3 v5.08,63.66 | v5.08,70.96 v11.43,70.96
INTPIC  (via drill 0.3)
  Top 0.254: IC104.18 25.4,36.04 24.13,37.31 v24.13,50.32 | v43.18,50.32 IC102.17 | v82.55,50.32 IC109.13
  Bottom 0.254: v24.13,50.32 v43.18,50.32 v82.55,50.32
N$1  (via drill 0.3)
  Top 0.254: v45.72,49.69 IC102.16
  Bottom 0.254: R101.1 v45.72,49.69
N$2  (via drill 0.3)
  Top 0.254: v6.99,56.04 v6.99,66.2
  Bottom 0.254: IC108.6 v6.99,56.04 | v6.99,66.2 IC108.2
N$3
  Top 0.61: SLOT101.B22 33.02,9.68 32.7,10 30.8,10 30.48,9.68 SLOT101.B23
N$4  (via drill 0.3)
  Top 0.254: v7.62,56.67 v7.62,61.12
  Bottom 0.254: IC108.9 8.26,56.04 v7.62,56.67 | v7.62,61.12 IC108.11
RC2014  (via drill 0.3)
  Top 0.254: IC109.4 62.23,45.56 63.5,44.29 v63.5,43.97 | v67.31,43.97 IC103.19
  Bottom 0.254: v63.5,43.97 v67.31,43.97

### Text on the board
tNames: +5V | IOEN | INTEN | WORK | PROG | I/O-Adressraum Wiesnertec / Device-ID: 192 / 0xC0 / 0x40 = Switched IO Manufaktor / 0x41 = Get Interruptchannel / 0x42 = /CS-PIC A0=0 / 0x43 = /CS-PIC A0=1 / 0x44 = INTA-READ / 0x45 = IM2-READ / 0x46 = Set I/O-Address / 0x47 = READ/WRITE I/O / 0x48..0x4F = n.c. | (c) Dr.-Ing. Th. Wiesner | msx_io_expander_slot.brd | 19.09.2025